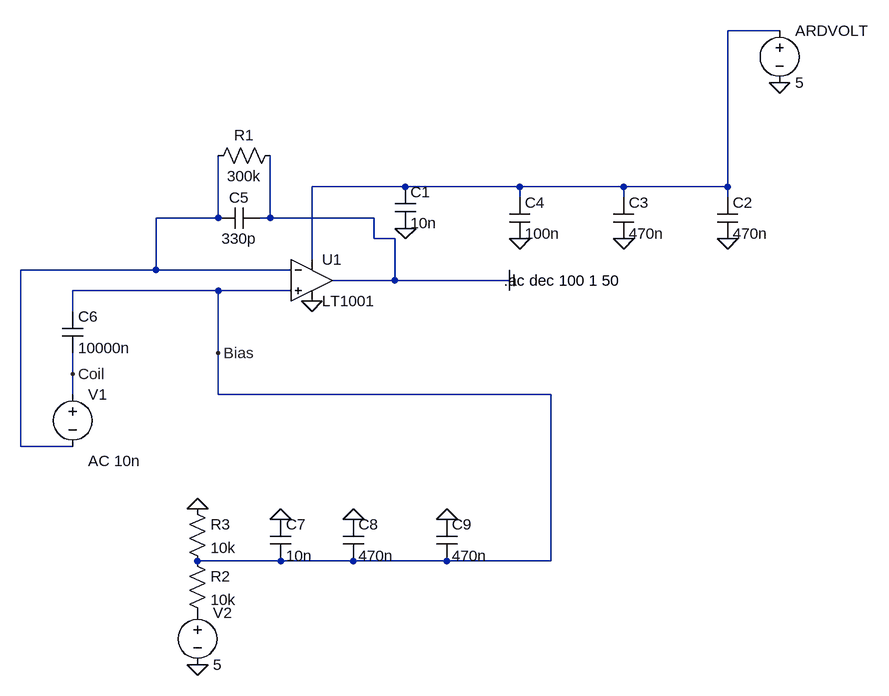
[diagram p0: schematic newAmptTest.asc]
newAmptTest.asc, the LTspice schematic file:
Version 4
SHEET 1 1716 960
WIRE 1584 -32 1504 -32
WIRE 1008 208 864 208
WIRE 1184 208 1008 208
WIRE 1344 208 1184 208
WIRE 1504 208 1504 -32
WIRE 1504 208 1344 208
WIRE 1184 224 1184 208
WIRE 1344 224 1344 208
WIRE 1504 224 1504 208
WIRE 720 256 720 160
WIRE 720 256 624 256
WIRE 800 256 800 160
WIRE 800 256 784 256
WIRE 960 256 800 256
WIRE 960 288 960 256
WIRE 992 288 960 288
WIRE 864 320 864 208
WIRE 624 336 624 256
WIRE 624 336 416 336
WIRE 832 336 624 336
WIRE 992 352 992 288
WIRE 992 352 896 352
WIRE 1168 352 992 352
WIRE 720 368 496 368
WIRE 832 368 720 368
WIRE 496 400 496 368
WIRE 720 464 720 368
WIRE 496 496 496 464
WIRE 496 528 496 496
WIRE 720 528 720 464
WIRE 1232 528 720 528
WIRE 416 608 416 336
WIRE 496 608 416 608
WIRE 816 784 688 784
WIRE 928 784 816 784
WIRE 1072 784 928 784
WIRE 1232 784 1232 528
WIRE 1232 784 1072 784
FLAG 1008 272 0
FLAG 1184 288 0
FLAG 1344 288 0
FLAG 1504 288 0
FLAG 864 384 0
FLAG 688 944 0
FLAG 688 704 0
FLAG 816 720 0
FLAG 928 720 0
FLAG 1072 720 0
FLAG 1584 48 0
FLAG 1168 352 COM
FLAG 496 496 Coil
FLAG 720 464 Bias
SYMBOL OpAmps/LT1001 864 288 R0
SYMATTR InstName U1
SYMBOL cap 992 208 R0
SYMATTR InstName C1
SYMATTR Value 10n
SYMBOL cap 1488 224 R0
SYMATTR InstName C2
SYMATTR Value 470n
SYMBOL cap 1328 224 R0
SYMATTR InstName C3
SYMATTR Value 470n
SYMBOL cap 1168 224 R0
SYMATTR InstName C4
SYMATTR Value 100n
SYMBOL Voltage 1584 -48 R0
SYMATTR InstName ARDVOLT
SYMATTR Value 5
SYMBOL cap 784 240 R90
WINDOW 0 0 32 VBottom 2
WINDOW 3 32 32 VTop 2
SYMATTR InstName C5
SYMATTR Value 330p
SYMBOL res 816 144 R90
WINDOW 0 0 56 VBottom 2
WINDOW 3 32 56 VTop 2
SYMATTR InstName R1
SYMATTR Value 300k
SYMBOL voltage 496 512 R0
WINDOW 123 24 118 Left 2
SYMATTR Value2 AC 10n
SYMATTR InstName V1
SYMATTR Value ""
SYMATTR SpiceLine Rser=800
SYMBOL cap 480 400 R0
SYMATTR InstName C6
SYMATTR Value 10000n
SYMBOL voltage 688 848 R0
SYMATTR InstName V2
SYMATTR Value 5
SYMBOL res 672 768 R0
SYMATTR InstName R2
SYMATTR Value 10k
SYMBOL res 672 688 R0
SYMATTR InstName R3
SYMATTR Value 10k
SYMBOL cap 800 720 R0
SYMATTR InstName C7
SYMATTR Value 10n
SYMBOL cap 912 720 R0
SYMATTR InstName C8
SYMATTR Value 470n
SYMBOL cap 1056 720 R0
SYMATTR InstName C9
SYMATTR Value 470n
TEXT 1160 352 Left 2 !.ac dec 100 1 50

The netlist it stands for:
* newAmptTest.asc
XU1 Bias N002 N001 0 COM LT1001  ; pins In+ In- V+ V- OUT
C1 N001 0 10n
C2 N001 0 470n
C3 N001 0 470n
C4 N001 0 100n
V§ARDVOLT N001 0 5
C5 COM N002 330p
R1 COM N002 300k
V1 Coil N002 AC 10n Rser=800
C6 Bias Coil 10000n
V2 P001 0 5
R2 Bias P001 10k
R3 0 Bias 10k
C7 0 Bias 10n
C8 0 Bias 470n
C9 0 Bias 470n
.ac dec 100 1 50
.lib LTC.lib
.backanno
.end